# EAGLE schematic current_sense_INA260 (EAGLE 8.2.2)
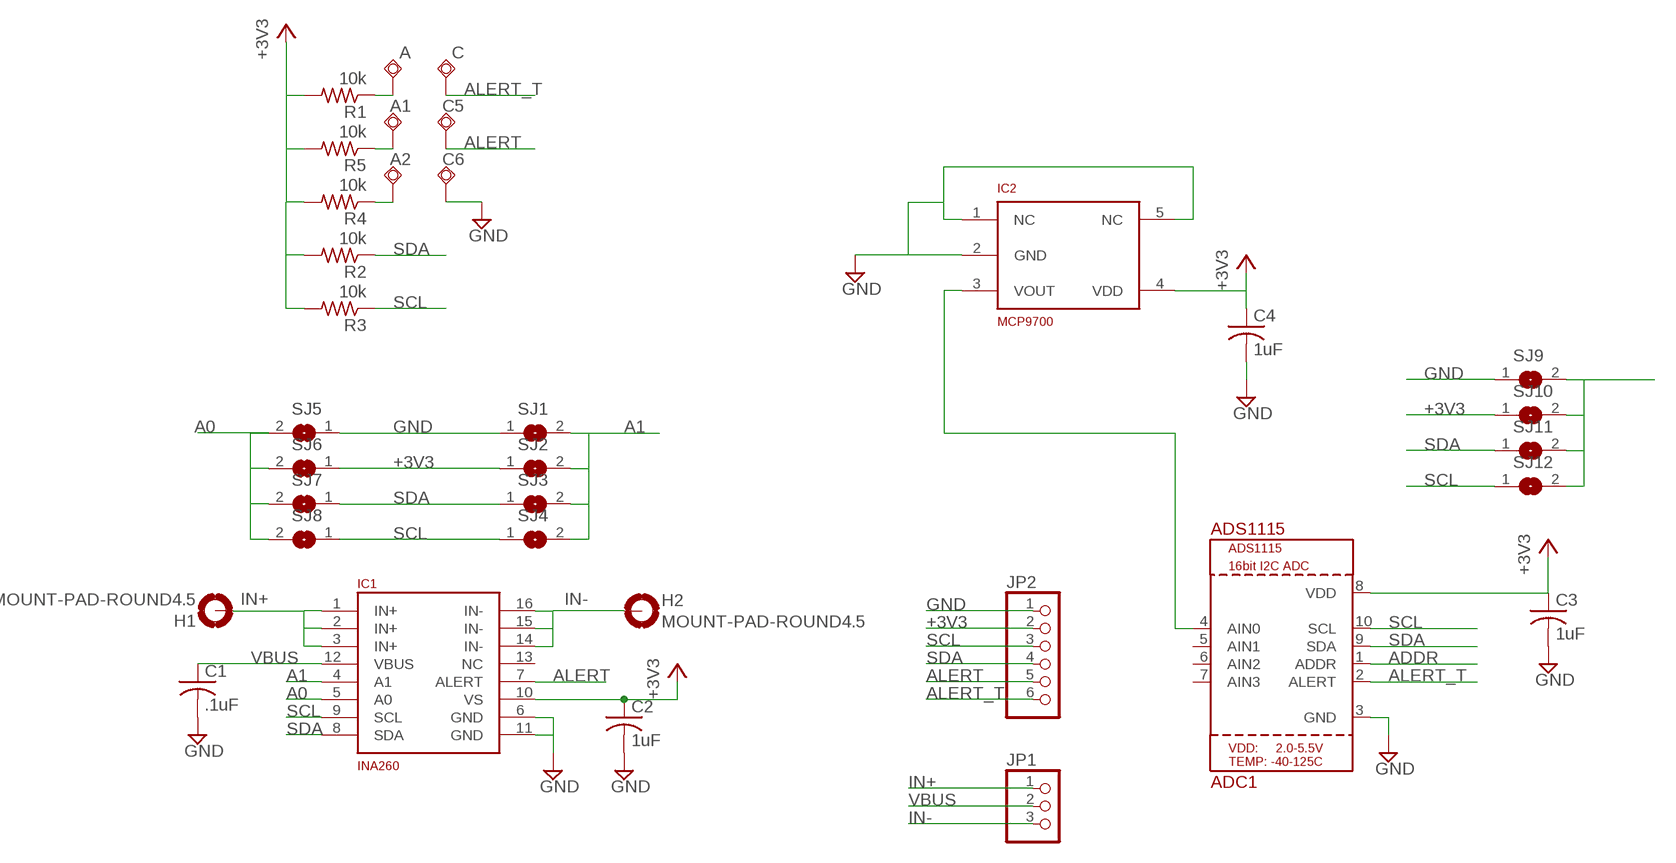
[diagram p0: schematic, sheet 1]

## Parts
A  TPSQTP20SQ  [TP20SQ]
A1  TPSQTP20SQ  [TP20SQ]
A2  TPSQTP20SQ  [TP20SQ]
ADC1  ADS1115  [MSOP10]
C  C  TPSQTP20SQ  [TP20SQ]
C1  .1uF  C-USC0805K  [C0805K]
C2  1uF  C-USC0805K  [C0805K]
C3  1uF  C-USC0805K  [C0805K]
C4  1uF  C-USC0805K  [C0805K]
C5  TPSQTP20SQ  [TP20SQ]
C6  TPSQTP20SQ  [TP20SQ]
H1  MOUNT-PAD-ROUND4.5  [4,5-PAD]
H2  MOUNT-PAD-ROUND4.5  [4,5-PAD]
IC1  INA260  [TSSOP16]
IC2  MCP9700  [SC70]
JP1  PINHD-1X3  [1X03]
JP2  PINHD-1X6  [1X06]
R1  10k  R-US_R0805  [R0805]
R2  10k  R-US_R0805  [R0805]
R3  10k  R-US_R0805  [R0805]
R4  10k  R-US_R0805  [R0805]
R5  10k  R-US_R0805  [R0805]
SJ1  SJ  [SJ]
SJ2  SJ  [SJ]
SJ3  SJ  [SJ]
SJ4  SJ  [SJ]
SJ5  SJ  [SJ]
SJ6  SJ  [SJ]
SJ7  SJ  [SJ]
SJ8  SJ  [SJ]
SJ9  SJ  [SJ]
SJ10  SJ  [SJ]
SJ11  SJ  [SJ]
SJ12  SJ  [SJ]

## Nets
+3V3: ADC1.8(VDD) C2.1 C3.1 C4.1 IC1.10(VS) IC2.4(VDD) JP2.2 R1.2 R2.2 R3.2 R4.2 R5.2 SJ2.1 SJ6.1 SJ10.1
A0: IC1.5(A0) SJ5.2 SJ6.2 SJ7.2 SJ8.2
A1: IC1.4(A1) SJ1.2 SJ2.2 SJ3.2 SJ4.2
ADDR: ADC1.1(ADDR) SJ9.2 SJ10.2 SJ11.2 SJ12.2
ALERT: C5.TP IC1.7(ALERT) JP2.5
ALERT_T: ADC1.2(ALERT) C.TP JP2.6
GND: ADC1.3(GND) C1.2 C2.2 C3.2 C4.2 C6.TP IC1.6(GND) IC1.11(GND) IC2.1(NC) IC2.2(GND) IC2.5(NC) JP2.1 SJ1.1 SJ5.1 SJ9.1
IN+: H1.B4,5(MOUNT) IC1.1(IN+) IC1.2(IN+) IC1.3(IN+) JP1.1
IN-: H2.B4,5(MOUNT) IC1.14(IN-) IC1.15(IN-) IC1.16(IN-) JP1.3
N$1: A2.TP R4.1
N$2: A1.TP R5.1
N$3: A.TP R1.1
SCL: ADC1.10(SCL) IC1.9(SCL) JP2.3 R3.1 SJ4.1 SJ8.1 SJ12.1
SDA: ADC1.9(SDA) IC1.8(SDA) JP2.4 R2.1 SJ3.1 SJ7.1 SJ11.1
V_TEMP: ADC1.4(AIN0) IC2.3(VOUT)
VBUS: C1.1 IC1.12(VBUS) JP1.2
Unconnected: ADC1.5(AIN1) ADC1.6(AIN2) ADC1.7(AIN3) IC1.13(NC)

## Library data of the parts
A A1 A2 C C5 C6 = testpad:TPSQ: Test pad
ADC1 = vtgs:ADS1115
C1-C4 = rcl:C-US: CAPACITOR, American symbol
H1 H2 = holes:MOUNT-PAD-ROUND: MOUNTING PAD, round
IC1 = vtgs:INA260
IC2 = vtgs:MCP9700
JP1 = pinhead:PINHD-1X3: PIN HEADER
JP2 = pinhead:PINHD-1X6: PIN HEADER
R1-R5 = rcl:R-US_: RESISTOR, American symbol
SJ1-SJ12 = jumper:SJ: SMD solder JUMPER